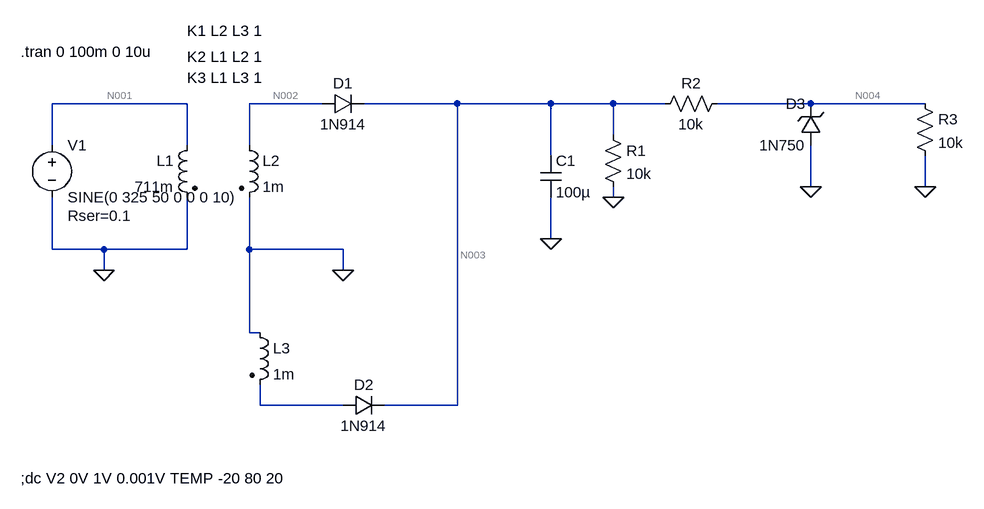
[diagram p0: schematic dioda.asc]
dioda.asc, the LTspice schematic file:
Version 4
SHEET 1 1004 680
WIRE -256 -16 -464 -16
WIRE -48 -16 -160 -16
WIRE 160 -16 16 -16
WIRE 304 -16 160 -16
WIRE 400 -16 304 -16
WIRE 480 -16 400 -16
WIRE 704 -16 560 -16
WIRE 880 -16 704 -16
WIRE 400 32 400 -16
WIRE -464 48 -464 -16
WIRE -256 48 -256 -16
WIRE -160 48 -160 -16
WIRE 304 64 304 -16
WIRE 704 112 704 48
WIRE 880 112 880 64
WIRE 400 128 400 112
WIRE 304 192 304 128
WIRE -464 208 -464 128
WIRE -384 208 -464 208
WIRE -256 208 -256 128
WIRE -256 208 -384 208
WIRE -160 208 -160 128
WIRE -16 208 -160 208
WIRE -384 240 -384 208
WIRE -16 240 -16 208
WIRE -160 336 -160 208
WIRE -144 336 -160 336
WIRE -144 448 -144 416
WIRE -16 448 -144 448
WIRE 160 448 160 -16
WIRE 160 448 48 448
FLAG -384 240 0
FLAG -16 240 0
FLAG 400 128 0
FLAG 304 192 0
FLAG 880 112 0
FLAG 704 112 0
SYMBOL voltage -464 32 R0
WINDOW 123 0 0 Left 2
WINDOW 39 24 124 Left 2
SYMATTR InstName V1
SYMATTR Value SINE(0 325 50 0 0 0 10)
SYMATTR SpiceLine Rser=0.1
SYMBOL ind2 -240 32 M0
SYMATTR InstName L1
SYMATTR Value 711m
SYMATTR Type ind
SYMBOL ind2 -176 32 R0
SYMATTR InstName L2
SYMATTR Value 1m
SYMATTR Type ind
SYMBOL diode -48 0 R270
WINDOW 0 32 32 VTop 2
WINDOW 3 0 32 VBottom 2
SYMATTR InstName D1
SYMATTR Value 1N914
SYMBOL cap 288 64 R0
SYMATTR InstName C1
SYMATTR Value 100µ
SYMBOL diode -16 464 R270
WINDOW 0 32 32 VTop 2
WINDOW 3 0 32 VBottom 2
SYMATTR InstName D2
SYMATTR Value 1N914
SYMBOL ind2 -160 320 R0
SYMATTR InstName L3
SYMATTR Value 1m
SYMATTR Type ind
SYMBOL res 384 16 R0
SYMATTR InstName R1
SYMATTR Value 10k
SYMBOL res 576 -32 R90
WINDOW 0 0 56 VBottom 2
WINDOW 3 32 56 VTop 2
SYMATTR InstName R2
SYMATTR Value 10k
SYMBOL zener 720 48 R180
WINDOW 0 24 64 Left 2
WINDOW 3 24 0 Left 2
SYMATTR InstName D3
SYMATTR Value 1N750
SYMATTR Description Diode
SYMATTR Type diode
SYMBOL res 864 -32 R0
SYMATTR InstName R3
SYMATTR Value 10k
TEXT -512 560 Left 2 !;dc V2 0V 1V 0.001V TEMP -20 80 20
TEXT -256 -88 Left 2 !K2 L1 L2 1
TEXT -512 -96 Left 2 !.tran 0 100m 0 10u
TEXT -256 -128 Left 2 !K1 L2 L3 1
TEXT -256 -56 Left 2 !K3 L1 L3 1

The netlist it stands for:
* dioda.asc
V1 N001 0 SINE(0 325 50 0 0 0 10) Rser=0.1
L1 N001 0 711m
L2 N002 0 1m
D1 N002 N003 1N914
C1 N003 0 100µ
D2 N005 N003 1N914
L3 0 N005 1m
R1 N003 0 10k
R2 N004 N003 10k
D3 0 N004 1N750
R3 N004 0 10k
.model D D
.lib standard.dio
;dc V2 0V 1V 0.001V TEMP -20 80 20
K2 L1 L2 1
.tran 0 100m 0 10u
K1 L2 L3 1
K3 L1 L3 1
.backanno
.end

* Results of the author's LTspice run, read from the files saved beside the schematic
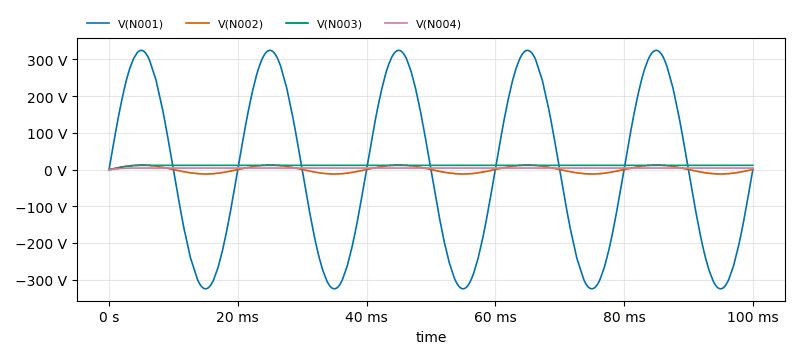
[diagram p1: Transient Analysis of dioda.asc, plotted from the saved traces]
* Transient Analysis, 1 run:
*   V(N001): min -325.1 V, max 324.8 V, average -153.4 mV, rms 229.9 V, last 2.033 mV
*   V(N002): min -12.19 V, max 12.18 V, average -5.753 mV, rms 8.622 V, last 76.23 µV
*   V(N003): min 0 V, max 11.49 V, average 11.17 V, rms 11.25 V, last 11.4 V
*   V(N004): min 0 V, max 4.025 V, average 3.955 V, rms 3.976 V, last 4.017 V